# Altium schematic sheet PERIPHERAL.SchDoc
size A3
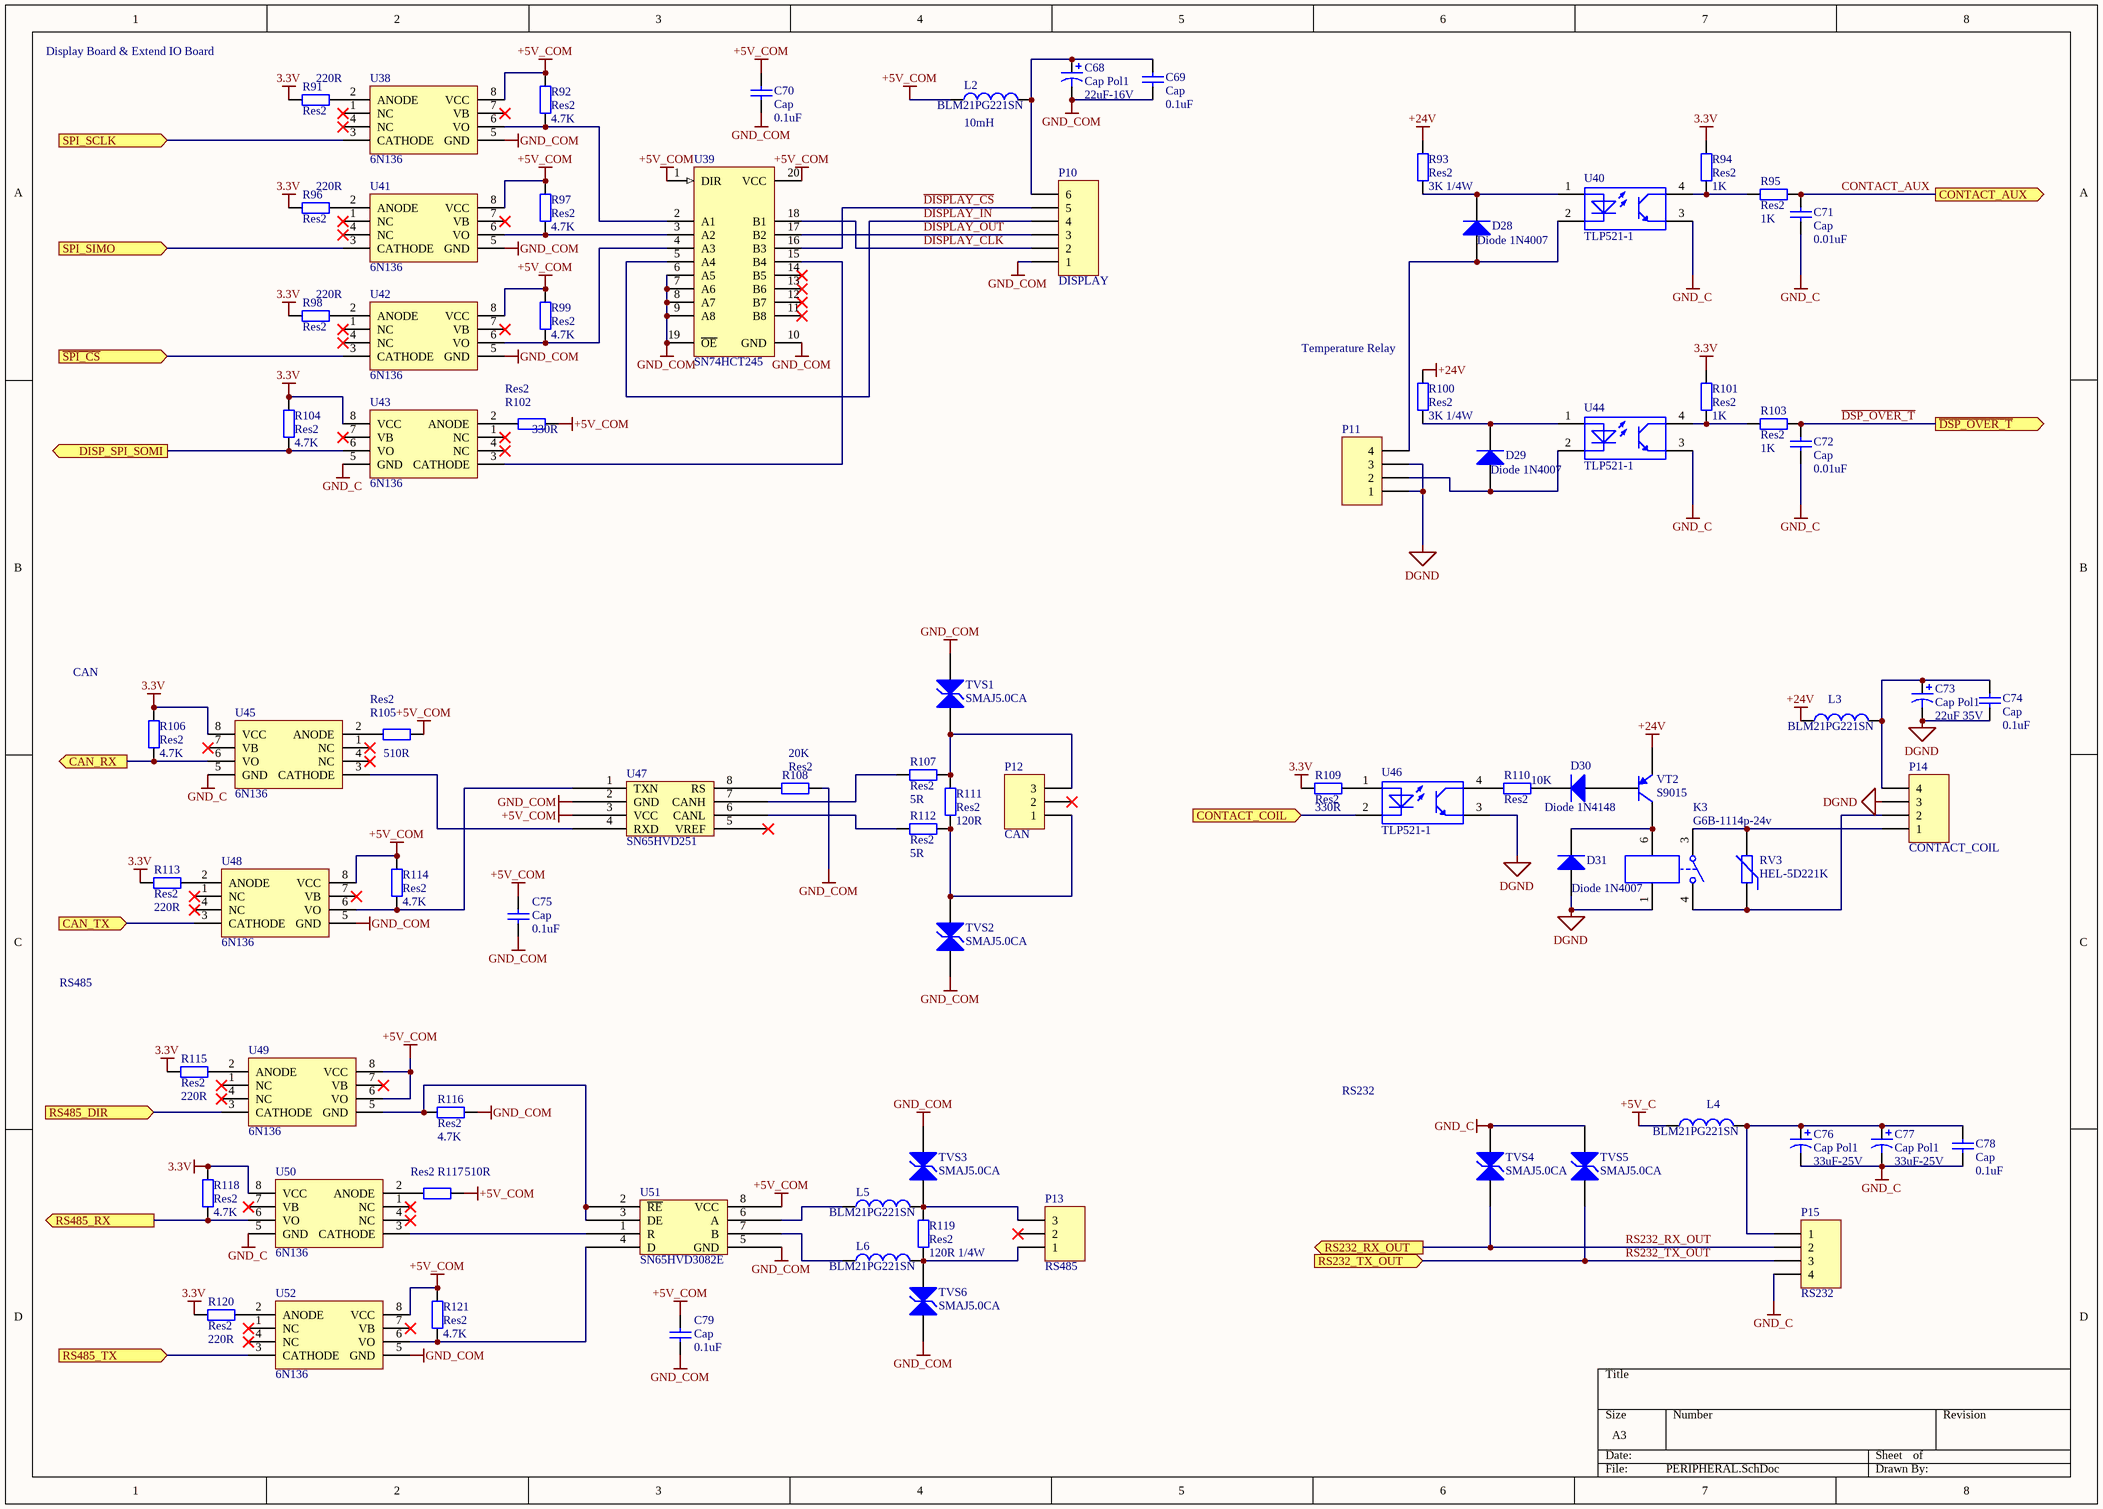
[diagram p0: PERIPHERAL.SchDoc]

## Parts
C68  Cap Pol1  value 22uF-16V  [7343]
C69  Cap  value 0.1uF  [1206]
C70  Cap  value 0.1uF  [1206]
C71  Cap  value 0.01uF  [1206]
C72  Cap  value 0.01uF  [1206]
C73  Cap Pol1  value 22uF 35V  [7343]
C74  Cap  value 0.1uF  [1206]
C75  Cap  value 0.1uF  [1206]
C76  Cap Pol1  value 33uF-25V  [7343]
C77  Cap Pol1  value 33uF-25V  [7343]
C78  Cap  value 0.1uF  [1206]
C79  Cap  value 0.1uF  [1206]
D28  Diode 1N4007  [SMA]
D29  Diode 1N4007  [SMA]
D30  Diode 1N4148  [SOD-80/MLL34]
D31  Diode 1N4007  [SMA]
K3  G6B-1114p-24v  [SPST-NO]
L2  BLM21PG221SN  value 10mH  [2012]
L3  BLM21PG221SN  [2012]
L4  BLM21PG221SN  [2012]
L5  BLM21PG221SN  [2012]
L6  BLM21PG221SN  [2012]
P10  DISPLAY  [phenox-6]
P11  TR  [PHONEX-4]  (value not drawn)
P12  CAN  [PHENOX-3]
P13  RS485  [PHENOX-3]
P14  CONTACT_COIL  [PHONEX-4]
P15  RS232  [PHONEX-4]
R91  Res2  value 220R  [1206]
R92  Res2  value 4.7K  [1206]
R93  Res2  value 3K 1/4W  [1206]
R94  Res2  value 1K  [1206]
R95  Res2  value 1K  [1206]
R96  Res2  value 220R  [1206]
R97  Res2  value 4.7K  [1206]
R98  Res2  value 220R  [1206]
R99  Res2  value 4.7K  [1206]
R100  Res2  value 3K 1/4W  [1206]
R101  Res2  value 1K  [1206]
R102  Res2  value 330R  [1206]
R103  Res2  value 1K  [1206]
R104  Res2  value 4.7K  [1206]
R105  Res2  value 510R  [1206]
R106  Res2  value 4.7K  [1206]
R107  Res2  value 5R  [1206]
R108  Res2  value 20K  [1206]
R109  Res2  value 330R  [1206]
R110  Res2  value 10K  [1206]
R111  Res2  value 120R  [1206]
R112  Res2  value 5R  [1206]
R113  Res2  value 220R  [1206]
R114  Res2  value 4.7K  [1206]
R115  Res2  value 220R  [1206]
R116  Res2  value 4.7K  [1206]
R117  Res2  value 510R  [1206]
R118  Res2  value 4.7K  [1206]
R119  Res2  value 120R 1/4W  [1206]
R120  Res2  value 220R  [1206]
R121  Res2  value 4.7K  [1206]
RV3  HEL-5D221K  [RAD-0.2]
TVS1  SMAJ5.0CA  [TVS-SMA]
TVS2  SMAJ5.0CA  [TVS-SMA]
TVS3  SMAJ5.0CA  [TVS-SMA]
TVS4  SMAJ5.0CA  [TVS-SMA]
TVS5  SMAJ5.0CA  [TVS-SMA]
TVS6  SMAJ5.0CA  [TVS-SMA]
U38  6N136  [DIP-8N]
U39  SN74HCT245  [SO20_M]
U40  TLP521-1  [DIP4]
U41  6N136  [DIP-8N]
U42  6N136  [DIP-8N]
U43  6N136  [DIP-8N]
U44  TLP521-1  [DIP4]
U45  6N136  [DIP-8N]
U46  TLP521-1  [DIP4]
U47  SN65HVD251  [SO-8]
U48  6N136  [DIP-8N]
U49  6N136  [DIP-8N]
U50  6N136  [DIP-8N]
U51  SN65HVD3082E  [SO-8]
U52  6N136  [DIP-8N]
VT2  S9015  [SOT23]

## Ports
CAN_RX (out), CAN_TX (in), CONTACT_AUX (out), CONTACT_COIL (in), DISP_SPI_SOMI (out), RS232_RX_OUT (out), RS232_TX_OUT (in), RS485_DIR (in), RS485_RX (out), RS485_TX (in), SPI_SCLK (in), SPI_SIMO (in), ~{DSP_OVER_T} (out), ~{SPI_CS} (in)

## Nets
3.3V: R91.1 R94.2 R96.1 R98.1 R101.2 R104.2 R106.2 R109.1 R113.1 R115.1 R118.2 R120.1 U43.8(VCC) U45.8(VCC) U50.8(VCC)
+5V_C: L4.1
+5V_COM: C70.2 C75.2 C79.2 L2.1 R92.2 R97.2 R99.2 R102.1 R105.1 R114.2 R117.1 R121.2 U38.8(VCC) U39.1(DIR) U39.20(VCC) U41.8(VCC) U42.8(VCC) U47.3(VCC) U48.8(VCC) U49.6(VO) U49.8(VCC) U51.8(VCC) U52.8(VCC)
+24V: L3.1 R93.2 R100.2 VT2.3(E)
DGND: C73.2 C74.1 D31.1(A) K3.1 P11.1 P11.3 P14.3 U46.3
GND_C: C71.1 C72.1 C76.2 C77.2 C78.1 P15.4 TVS4.2(K) TVS5.2(K) U40.3 U43.5(GND) U44.3 U45.5(GND) U50.5(GND)
GND_COM: C68.2 C69.1 C70.1 C75.1 C79.1 P10.1 R108.2 R116.2 TVS1.2(K) TVS2.1(A) TVS3.1(A) TVS6.2(K) U38.5(GND) U39.6(A5) U39.7(A6) U39.8(A7) U39.9(A8) U39.10(GND) U39.19(~{OE}) U41.5(GND) U42.5(GND) U47.2(GND) U48.5(GND) U51.5(GND) U52.5(GND)
~{SPI_CS}: U42.3(CATHODE) ; port ~{SPI_CS}
CAN_RX: R106.1 U45.6(VO) ; port CAN_RX
CAN_TX: U48.3(CATHODE) ; port CAN_TX
CONTACT_AUX: C71.2 R95.1 ; port CONTACT_AUX
CONTACT_COIL: U46.2 ; port CONTACT_COIL
~{DISPLAY_CS}: P10.5 U39.16(B3)
~{DSP_OVER_T}: C72.2 R103.1 ; port ~{DSP_OVER_T}
DISP_SPI_SOMI: R104.1 U43.6(VO) ; port DISP_SPI_SOMI
DISPLAY_CLK: P10.2 U39.18(B1)
DISPLAY_IN: P10.4 U39.5(A4)
DISPLAY_OUT: P10.3 U39.17(B2)
RS232_RX_OUT: P15.2 TVS4.1(A) ; port RS232_RX_OUT
RS232_TX_OUT: P15.3 TVS5.1(A) ; port RS232_TX_OUT
RS485_DIR: U49.3(CATHODE) ; port RS485_DIR
RS485_RX: R118.1 U50.6(VO) ; port RS485_RX
RS485_TX: U52.3(CATHODE) ; port RS485_TX
SPI_SCLK: U38.3(CATHODE) ; port SPI_SCLK
SPI_SIMO: U41.3(CATHODE) ; port SPI_SIMO
NetC68_1: C68.1 C69.2 L2.2 P10.6
NetC73_1: C73.1 C74.2 L3.2 P14.4
NetC76_1: C76.1 C77.1 C78.2 L4.2 P15.1
NetD28_1: D28.1(A) P11.4 U40.2
NetD28_2: D28.2(K) R93.1 U40.1
NetD29_1: D29.1(A) P11.2 U44.2
NetD29_2: D29.2(K) R100.1 U44.1
NetD30_1: D30.1(A) VT2.2(B)
NetD30_2: D30.2(K) R110.2
NetD31_2: D31.2(K) K3.6 VT2.1(C)
NetK3_3: K3.3 P14.1 RV3.2
NetK3_4: K3.4 P14.2 RV3.1
NetL5_1: L5.1 U51.6(A)
NetL5_2: L5.2 P13.3 R119.2 TVS3.2(K)
NetL6_1: L6.1 U51.7(B)
NetL6_2: L6.2 P13.1 R119.1 TVS6.1(A)
NetP12_1: P12.1 R111.1 R112.2 TVS2.2(K)
NetP12_3: P12.3 R107.2 R111.2 TVS1.1(A)
NetR91_2: R91.2 U38.2(ANODE)
NetR92_1: R92.1 U38.6(VO) U39.2(A1)
NetR94_1: R94.1 R95.2 U40.4
NetR96_2: R96.2 U41.2(ANODE)
NetR97_1: R97.1 U39.3(A2) U41.6(VO)
NetR98_2: R98.2 U42.2(ANODE)
NetR99_1: R99.1 U39.4(A3) U42.6(VO)
NetR101_1: R101.1 R103.2 U44.4
NetR102_2: R102.2 U43.2(ANODE)
NetR105_2: R105.2 U45.2(ANODE)
NetR107_1: R107.1 U47.7(CANH)
NetR108_1: R108.1 U47.8(RS)
NetR109_2: R109.2 U46.1
NetR110_1: R110.1 U46.4
NetR112_1: R112.1 U47.6(CANL)
NetR113_2: R113.2 U48.2(ANODE)
NetR114_1: R114.1 U47.1(TXN) U48.6(VO)
NetR115_2: R115.2 U49.2(ANODE)
NetR116_1: R116.1 U49.5(GND) U51.2(~{RE}) U51.3(DE)
NetR117_2: R117.2 U50.2(ANODE)
NetR120_2: R120.2 U52.2(ANODE)
NetR121_1: R121.1 U51.4(D) U52.6(VO)
NetU39_15: U39.15(B4) U43.3(CATHODE)
NetU45_3: U45.3(CATHODE) U47.4(RXD)
NetU50_3: U50.3(CATHODE) U51.1(R)

Not connected (* = marked no-connect by the designer): P12 2*; P13 2*; U38 1(NC)* 4(NC)* 7(VB)*; U39 11(B8)* 12(B7)* 13(B6)* 14(B5)*; U41 1(NC)* 4(NC)* 7(VB)*; U42 1(NC)* 4(NC)* 7(VB)*; U43 1(NC)* 4(NC)* 7(VB)*; U45 1(NC)* 4(NC)* 7(VB)*; U47 5(VREF)*; U48 1(NC)* 4(NC)* 7(VB)*; U49 1(NC)* 4(NC)* 7(VB)*; U50 1(NC)* 4(NC)* 7(VB)*; U52 1(NC)* 4(NC)* 7(VB)*

## Notes on the sheet
- Display Board & Extend IO Board
- (near R100) Temperature Relay
- CAN
- RS485
- RS232

## Library data of the parts
C68 C73 C76 C77 = Cap Pol1: Polarized Capacitor (Radial); Published: 8-Jun-2000; LatestRevisionDate: 17-Jul-2002; LatestRevisionNote: Re-released for DXP Platform.; PackageReference: RB7.6-15; Publisher: Altium Limited
C69-C72 C74 C75 C78 C79 = Cap: Capacitor; Published: 8-Jun-2000; LatestRevisionDate: 17-Jul-2002; LatestRevisionNote: Re-released for DXP Platform.; PackageReference: RAD-0.3; Publisher: Altium Limited
D28 D29 D31 = Diode 1N4007: 1 Amp General Purpose Rectifier; Published: 8-Jun-2000; LatestRevisionDate: 17-Jul-2002; LatestRevisionNote: Re-released for DXP Platform.; DatasheetVersion: 1998; PackageVersion: Aug-1999; PackageReference: DO-41; Publisher: Altium Limited; Code_JEDEC: DO-204-AL; ComponentLink1Description: Manufacturer Link; ComponentLink1URL: http://www.fairchildsemi.com/; ComponentLink2Description: Datasheet; ComponentLink2URL: http://www.fairchildsemi.com/ds/1N%2F1N4001.pdf
D30 = Diode 1N4148: High Conductance Fast Diode; Published: 8-Jun-2000; LatestRevisionDate: 17-Jul-2002; LatestRevisionNote: Re-released for DXP Platform.; DatasheetVersion: 1997; PackageReference: DO-35; Publisher: Altium Limited; Code_JEDEC: DO-204-AH; ComponentLink1Description: Manufacturer Link; ComponentLink1URL: http://www.fairchildsemi.com/; ComponentLink2Description: Datasheet; ComponentLink2URL: http://www.fairchildsemi.com/ds/1N%2F1N4148.pdf
K3 = Relay-SPST: Single-Pole Single-Throw Relay; Published: 24-Mar-1999; LatestRevisionDate: 17-Jul-2002; LatestRevisionNote: Re-released for DXP Platform.; PackageReference: MODULE4; Publisher: Altium Limited
L2 = Inductor: Code_IEC: 1005; Published: 8-Jun-2000; LatestRevisionDate: 29-May-2009; LatestRevisionNote: IPC-7351 Footprint Added.; PackageReference: 0402-A; Publisher: Altium Limited; PackageDescription: Chip Inductor; Code_JEITA: 0402
L4-L6 = Inductor: Code_IEC: 1005; Value: 10mH; Published: 8-Jun-2000; LatestRevisionDate: 29-May-2009; LatestRevisionNote: IPC-7351 Footprint Added.; PackageReference: 0402-A; Publisher: Altium Limited; PackageDescription: Chip Inductor; Code_JEITA: 0402
P10 = Header 6: Header, 6-Pin; LatestRevisionDate: 17-Jul-2002; LatestRevisionNote: Re-released for DXP Platform.; Publisher: Altium Limited
P11 P14 P15 = Header 4: Header, 4-Pin; LatestRevisionDate: 17-Jul-2002; LatestRevisionNote: Re-released for DXP Platform.; Publisher: Altium Limited
P12 P13 = Header 3: Header, 3-Pin; LatestRevisionDate: 17-Jul-2002; LatestRevisionNote: Re-released for DXP Platform.; Publisher: Altium Limited
R91-R121 = Res2: Resistor; Published: 8-Jun-2000; LatestRevisionDate: 17-Jul-2002; LatestRevisionNote: Re-released for DXP Platform.; PackageReference: AXIAL-0.4; Publisher: Altium Limited
U38 U41-U43 U45 U48-U50 U52 = 6N136: 光耦